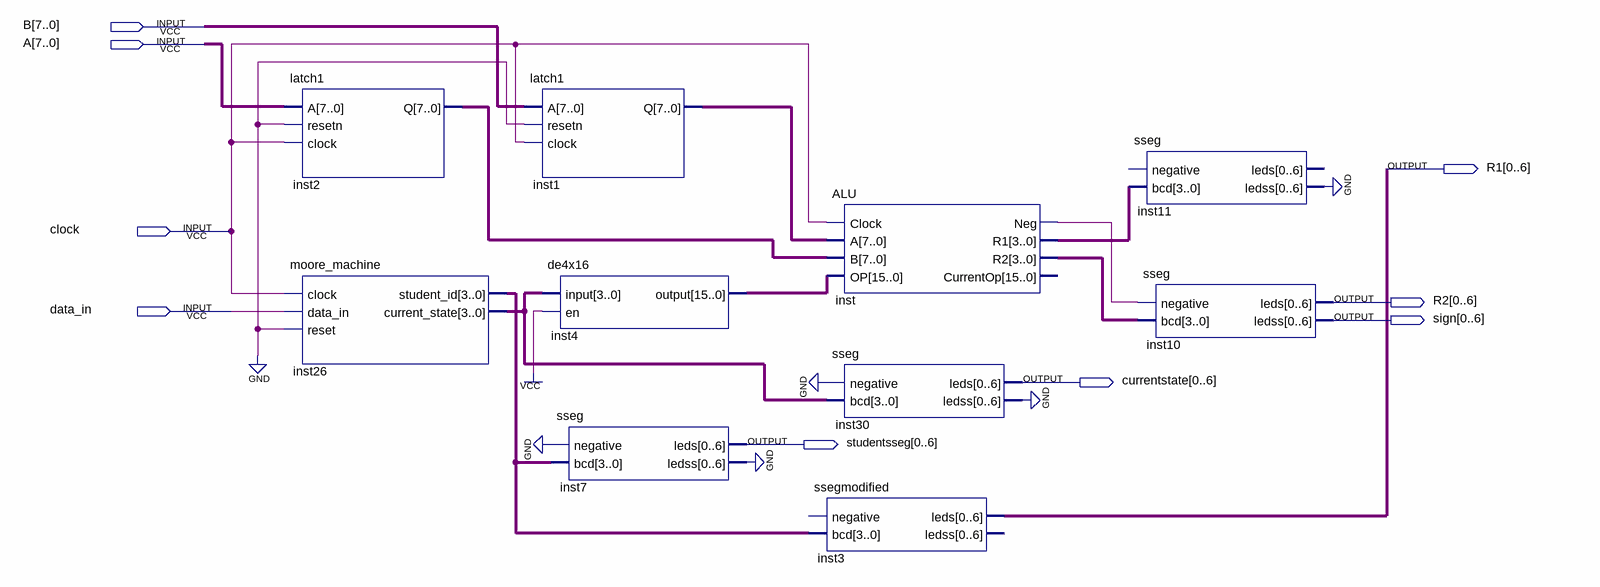
[diagram p0: schematic sheet]
// Quartus schematic everything.bdf as structural Verilog: 10 symbols, 9 pins
module everything (
  input  [7:0] B,
  input  [7:0] A,
  input  clock,
  input  data_in,
  output [0:6] R1,
  output [0:6] R2,
  output [0:6] sign,
  output [0:6] currentstate,
  output [0:6] studentsseg
);

  wire inst_neg;
  wire [3:0] inst26_current_state, inst26_student_id, inst_r1, inst_r2;
  wire [6:0] inst7_ledss, inst11_ledss, inst30_ledss;
  wire [7:0] inst1_q, inst2_q;
  wire [15:0] inst4_output;

  latch1 inst2 (.A(A), .resetn(1'b0), .clock(clock), .Q(inst2_q));
  moore_machine inst26 (
    .clock(clock), .data_in(data_in), .reset(1'b0), .student_id(inst26_student_id),
    .current_state(inst26_current_state));
  latch1 inst1 (.A(B), .resetn(1'b0), .clock(clock), .Q(inst1_q));
  de4x16 inst4 (.\input (inst26_current_state), .en(1'b1), .\output (inst4_output));
  sseg inst7 (.negative(1'b0), .bcd(inst26_student_id), .leds(studentsseg), .ledss(inst7_ledss));
  ALU inst (
    .Clock(clock), .A(inst1_q), .B(inst2_q), .OP(inst4_output), .Neg(inst_neg), .R1(inst_r1), .R2(inst_r2));  // open: CurrentOp
  sseg inst30 (.negative(1'b0), .bcd(inst26_current_state), .leds(currentstate), .ledss(inst30_ledss));
  ssegmodified inst3 (.bcd(inst26_student_id), .leds(R1));  // open: negative, ledss
  sseg inst11 (.bcd(inst_r1), .ledss(inst11_ledss));  // open: negative, leds
  sseg inst10 (.negative(inst_neg), .bcd(inst_r2), .leds(R2), .ledss(sign));
  // also tied to GND on the sheet: {inst7_ledss[0], inst7_ledss[1], inst7_ledss[2], inst7_ledss[3], inst7_ledss[4], inst7_ledss[5], inst7_ledss[6], inst30_ledss[0], inst30_ledss[1], inst30_ledss[2], inst30_ledss[3], inst30_ledss[4], inst30_ledss[5], inst30_ledss[6], inst11_ledss[0], inst11_ledss[1], inst11_ledss[2], inst11_ledss[3], inst11_ledss[4], inst11_ledss[5], inst11_ledss[6]}
endmodule
